# EAGLE schematic Goldfish BigBoard 2- revisions after produced board (EAGLE 6.5.0)
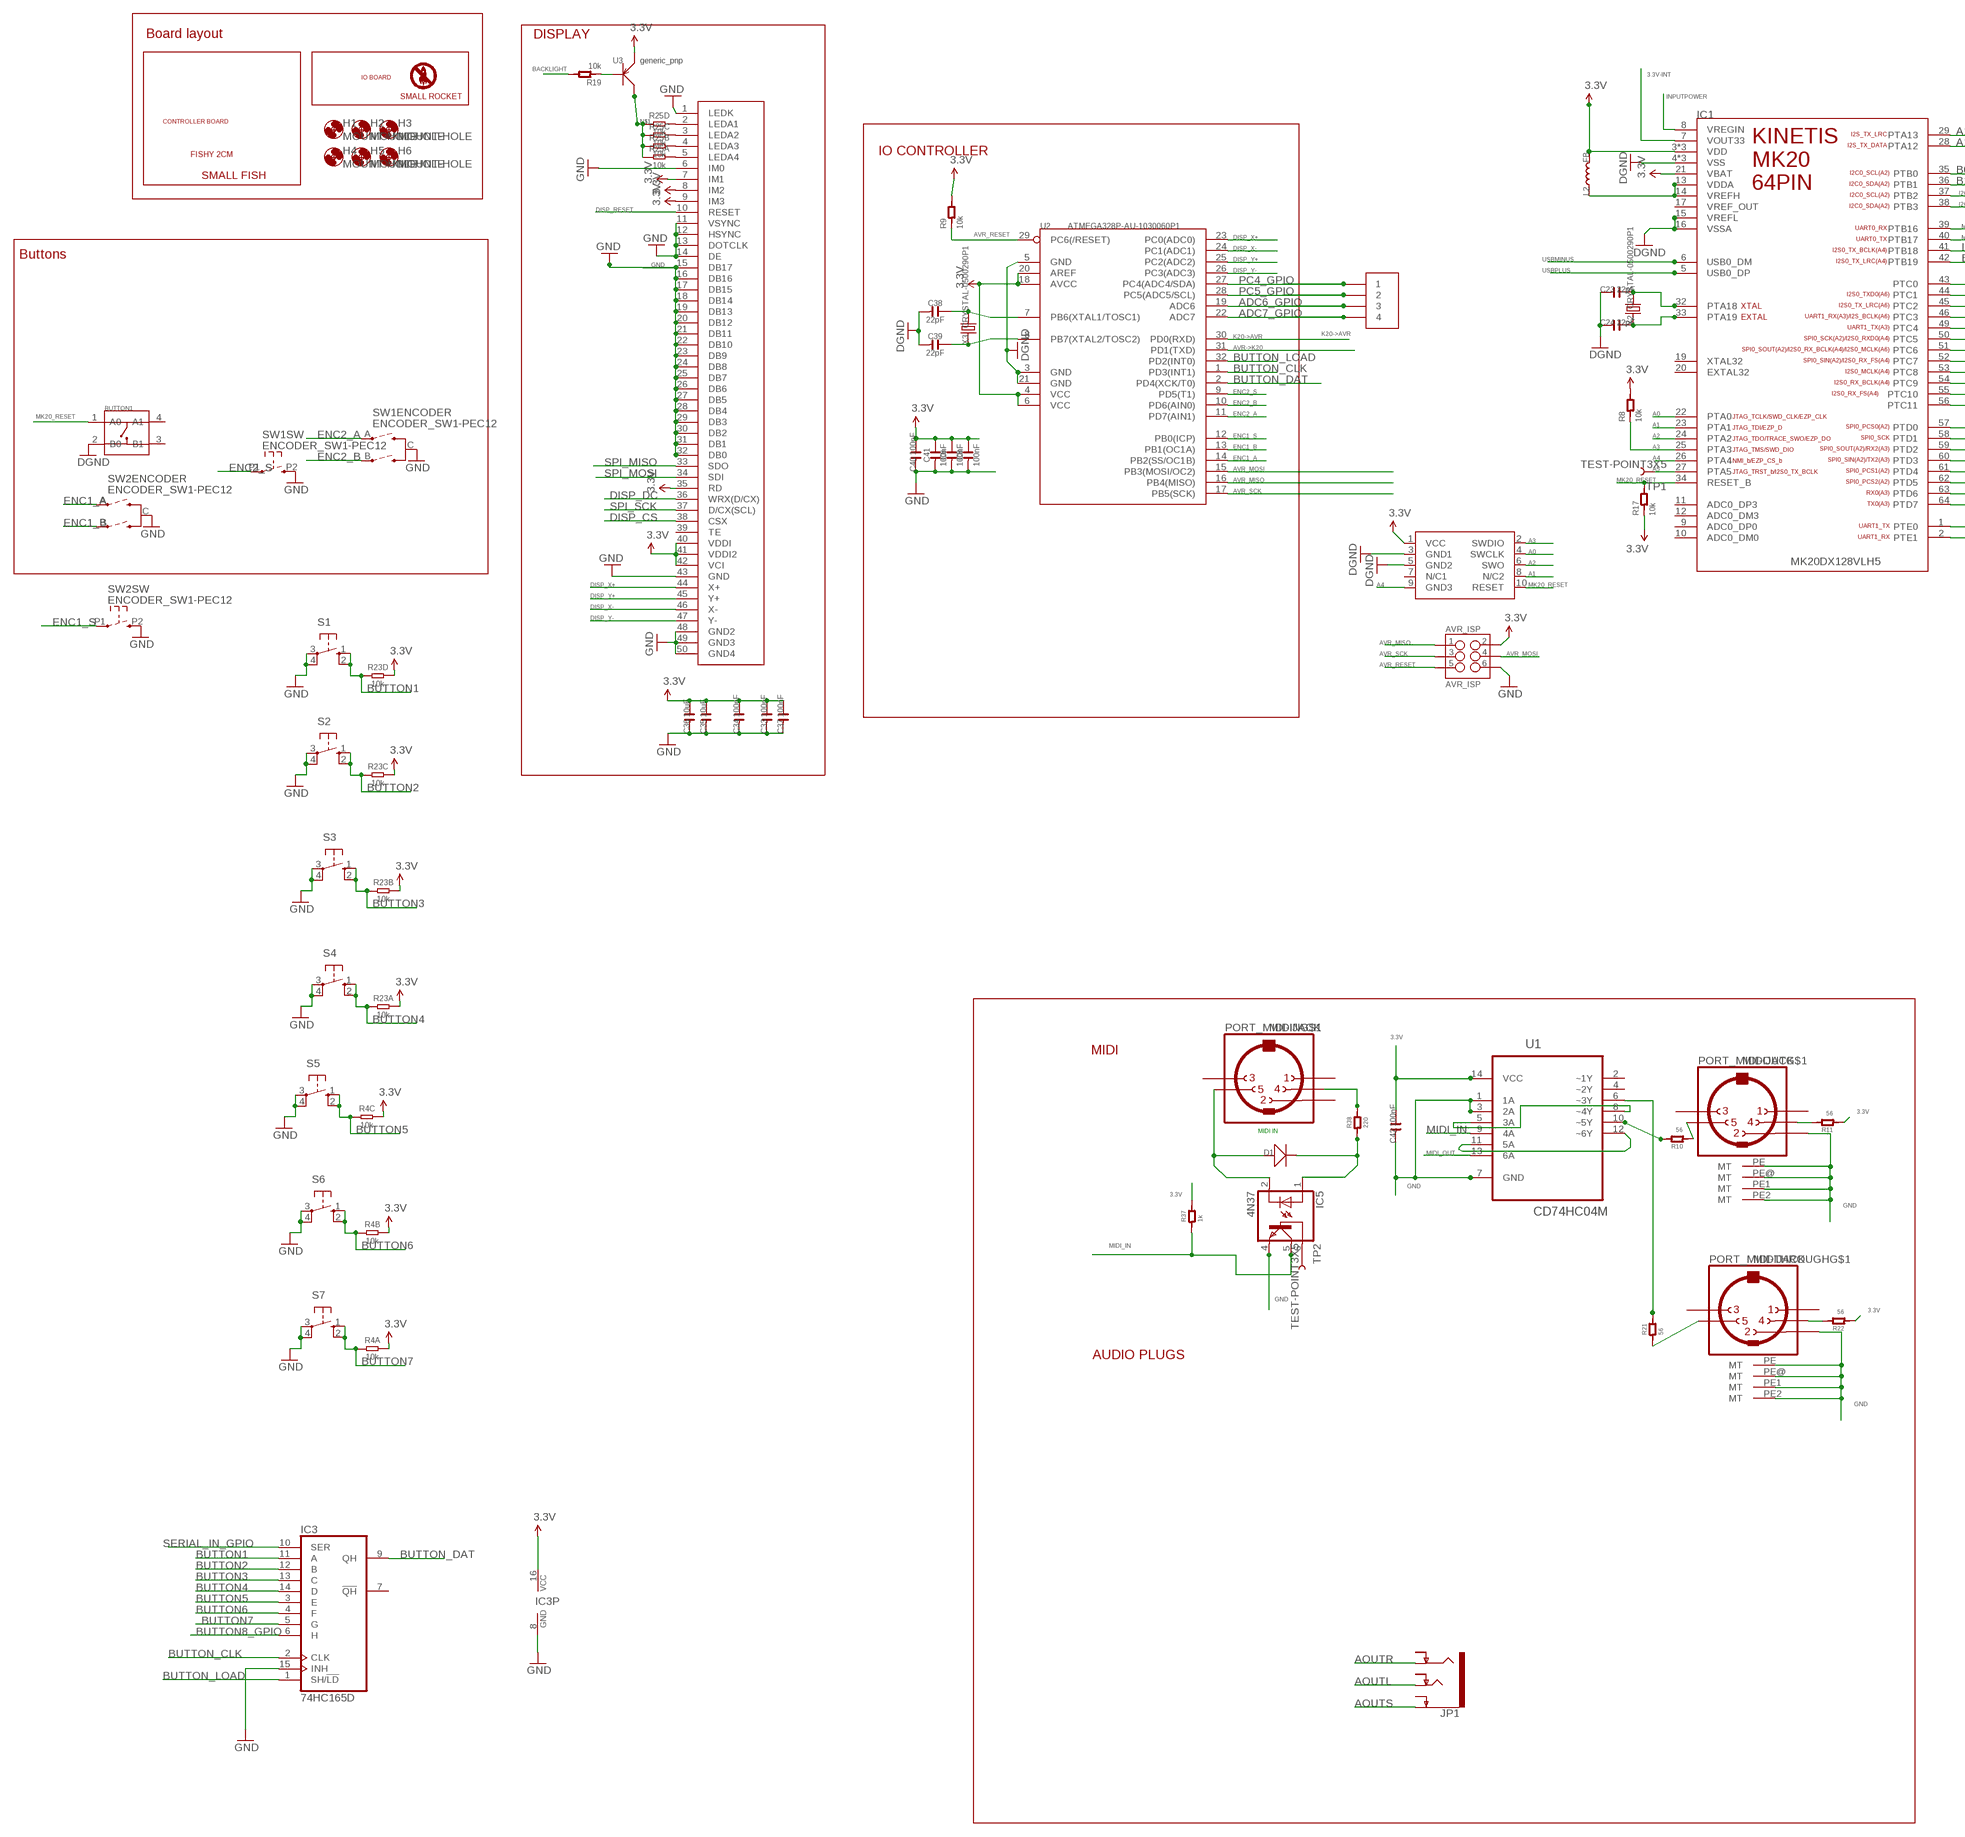
[diagram p0: schematic, sheet 1, part 1 of 3]
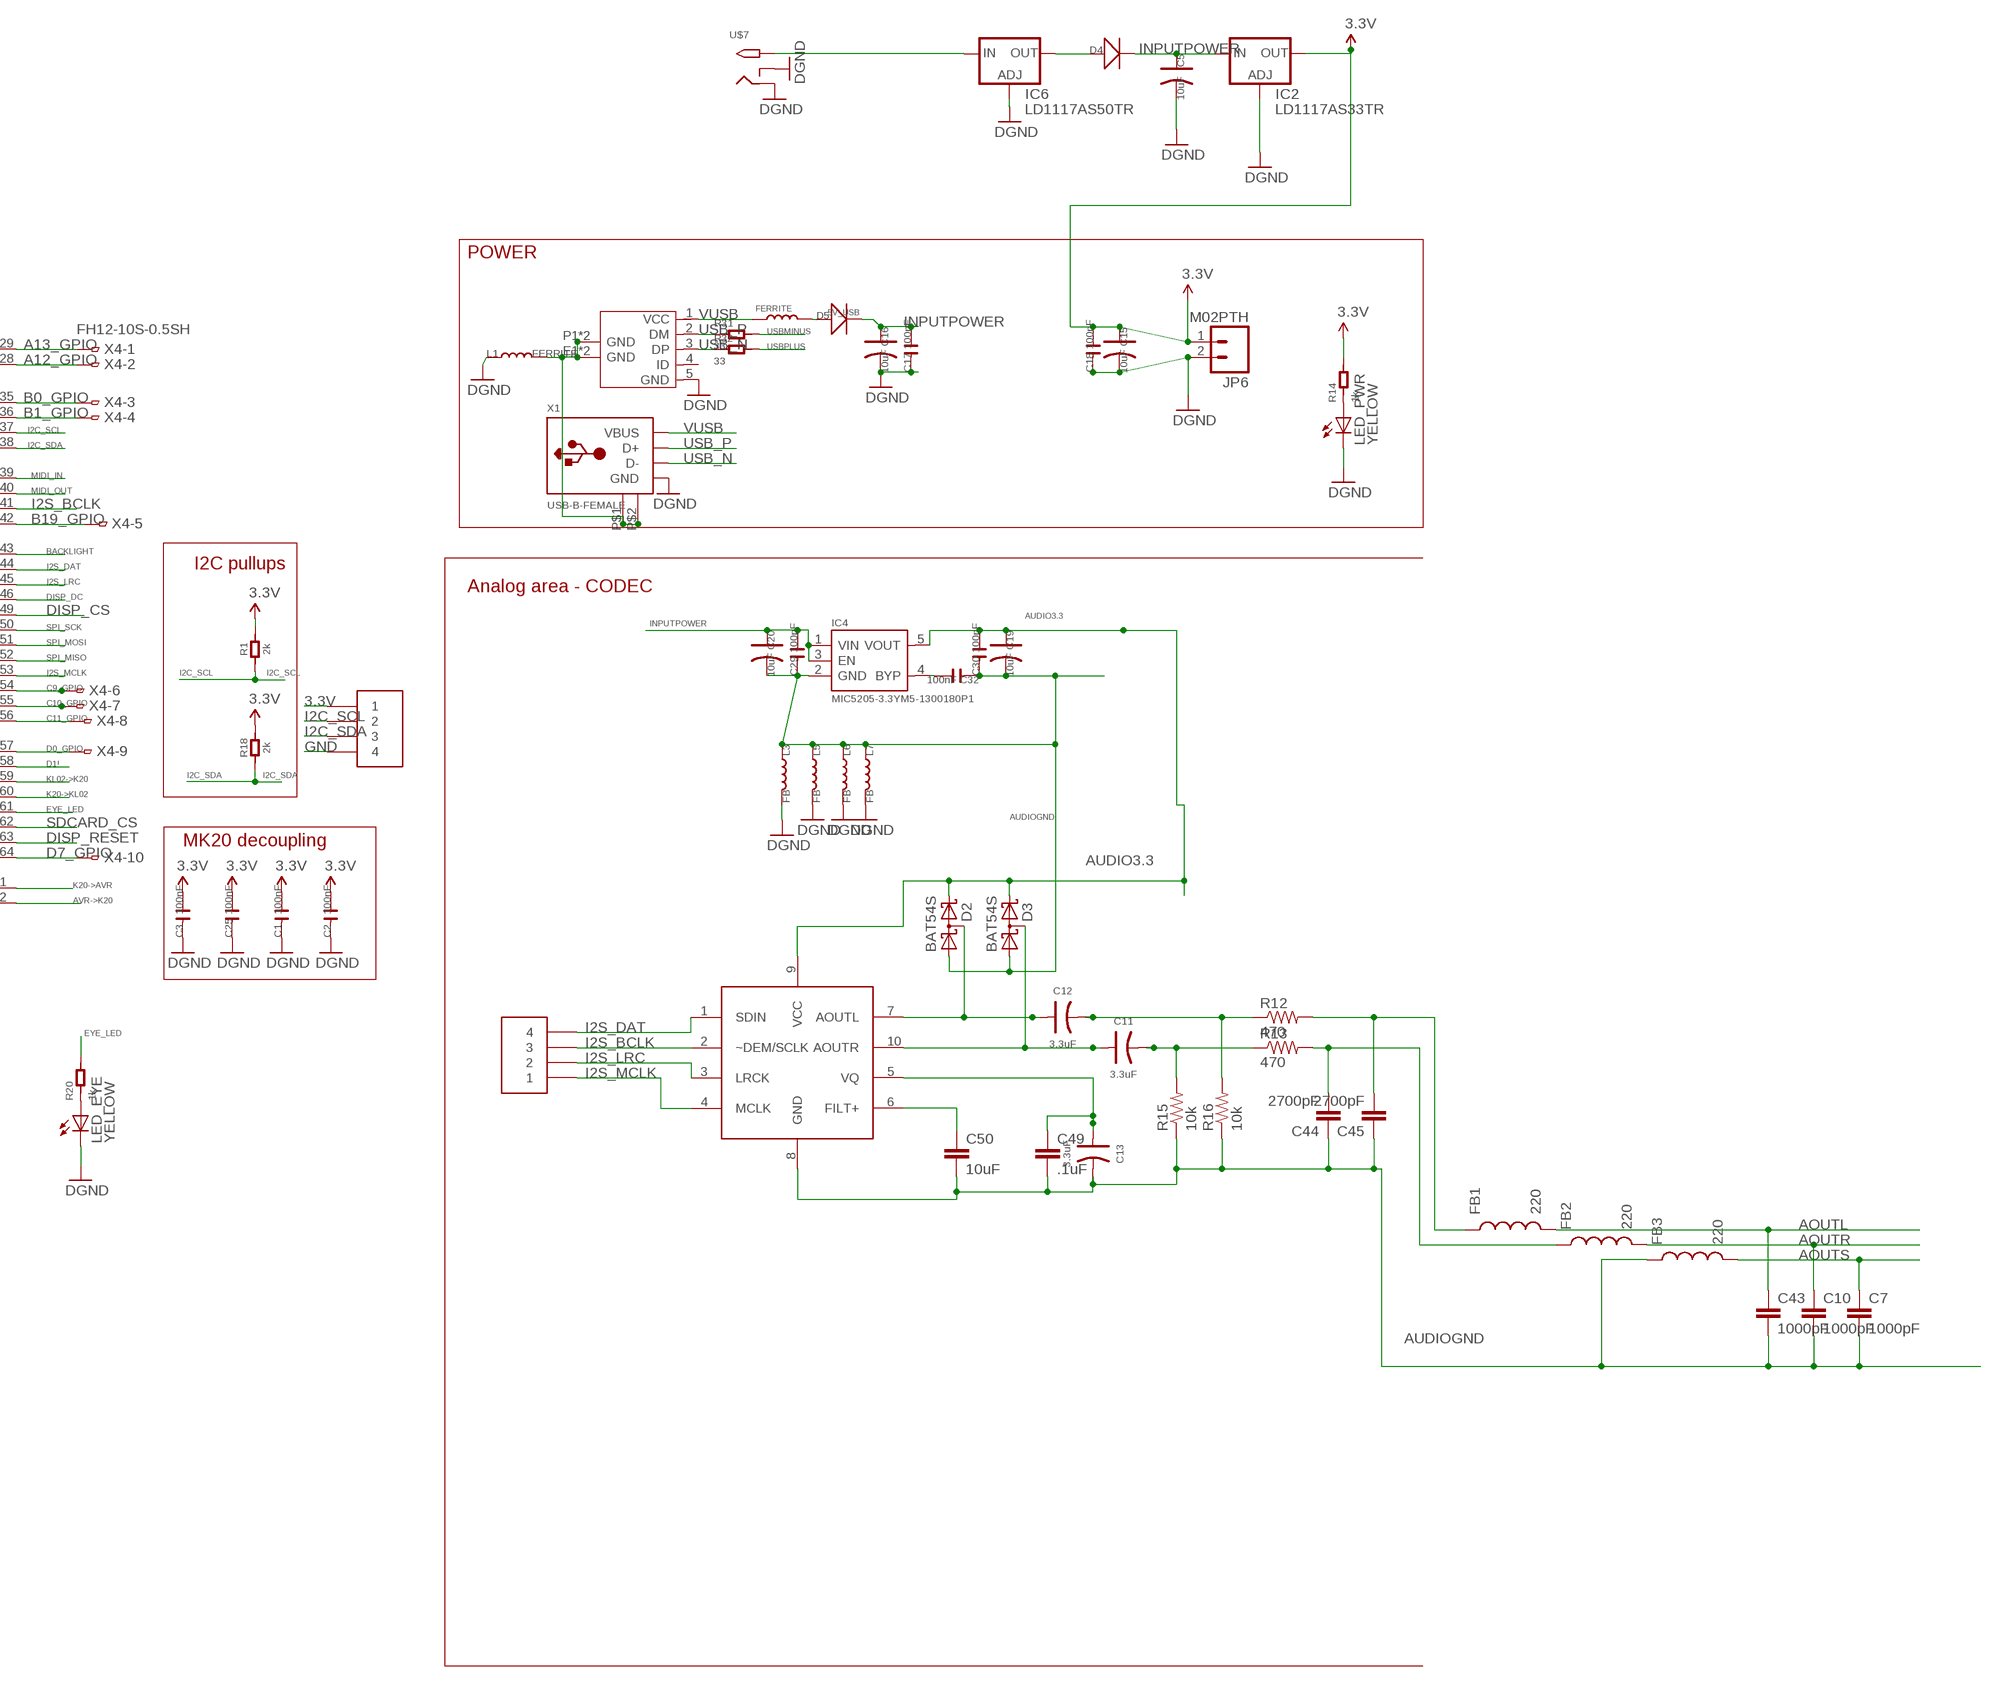
[diagram p1: schematic, sheet 1, part 2 of 3]
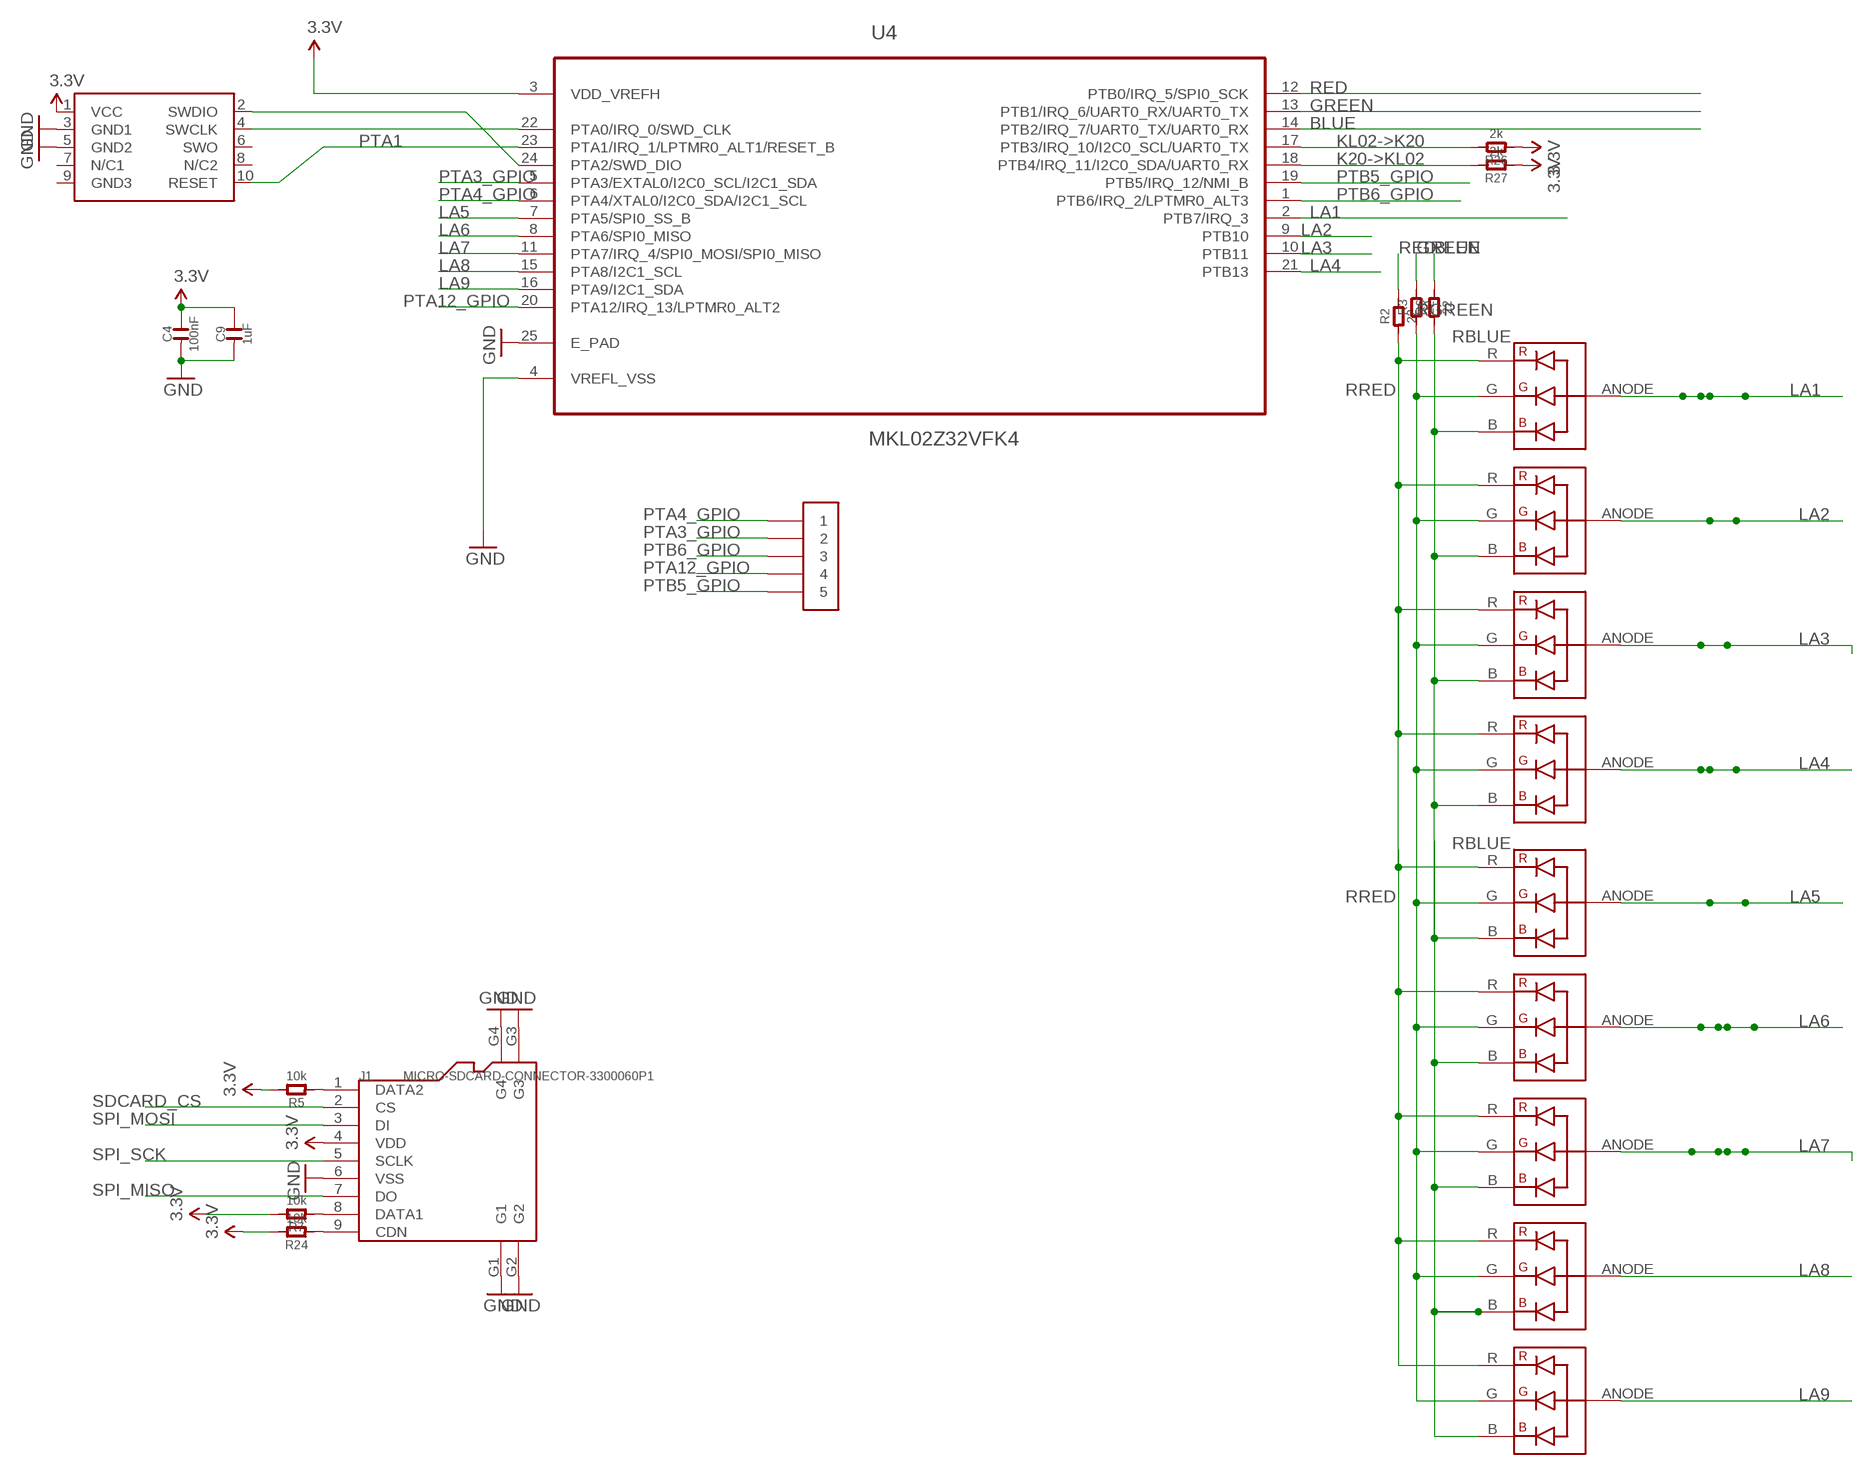
[diagram p2: schematic, sheet 1, part 3 of 3]

## Parts
AVR_ISP  AVR_ISP  M03X2SMT  [2X3_SMT_POSTS]
BUTTON1  BUTTON-4P-3100010P1  [4P-SMD-6.0X6.0X5.0H]
C1  100nF  C-0603  [C0603]
C2  100nF  C-0603  [C0603]
C3  100nF  C-0603  [C0603]
C4  100nF  C-0603  [C0603]
C5  10uF  C-POLAR-A  [AVX-A]
C6  100nF  C-0603  [C0603]
C7  1000pF  CAP0402-CAP  [0402-CAP]
C8  100nF  C-0603  [C0603]
C9  1uF  C-0603  [C0603]
C10  1000pF  CAP0402-CAP  [0402-CAP]
C11  3.3uF  C-POLAR-A  [AVX-A]
C12  3.3uF  C-POLAR-A  [AVX-A]
C13  3.3uF  C-POLAR-A  [AVX-A]
C15  10uF  C-POLAR-A  [AVX-A]
C16  10uF  C-POLAR-A  [AVX-A]
C17  100nF  C-0603  [C0603]
C18  100nF  C-0603  [C0603]
C19  10uF  C-POLAR-A  [AVX-A]
C20  10uF  C-POLAR-A  [AVX-A]
C23  22pF  C-0603  [C0603]
C24  22pF  C-0603  [C0603]
C25  100nF  C-0603  [C0603]
C29  100nF  C-0603  [C0603]
C30  100nF  C-0603  [C0603]
C32  100nF  C-0603  [C0603]
C33  100nF  C-0603  [C0603]
C34  100nF  C-0603  [C0603]
C35  10uF  C-0603  [C0603]
C36  10uF  C-0805  [C0805]
C37  100nF  C-0805  [C0805]
C38  22pF  C-0603  [C0603]
C39  22pF  C-0603  [C0603]
C40  100nF  C-0603  [C0603]
C41  100nF  C-0603  [C0603]
C42  100nF  C-0603  [C0603]
C43  1000pF  CAP0402-CAP  [0402-CAP]
C44  2700pF  CAP0402-CAP  [0402-CAP]
C45  2700pF  CAP0402-CAP  [0402-CAP]
C49  .1uF  CAP0402-CAP  [0402-CAP]
C50  10uF  CAP0402-CAP  [0402-CAP]
D1  D-D1206  [LL-34]
D2  BAT54S  [SOT23]
D3  BAT54S  [SOT23]
D4  D-D1206  [LL-34]
D5  D-D1206  [LL-34]
FB1  220  INDUCTOR0805  [0805]
FB2  220  INDUCTOR0805  [0805]
FB3  220  INDUCTOR0805  [0805]
H1  MOUNT-HOLE  [3.2-NOMARKINGS-SMALLSAFEZONE]
H2  MOUNT-HOLE  [3.2-NOMARKINGS-SMALLSAFEZONE]
H3  MOUNT-HOLE  [3.2-NOMARKINGS-SMALLSAFEZONE]
H4  MOUNT-HOLE  [3.2-NOMARKINGS-SMALLSAFEZONE]
H5  MOUNT-HOLE  [3.2-NOMARKINGS-SMALLSAFEZONE]
H6  MOUNT-HOLE  [3.2-NOMARKINGS-SMALLSAFEZONE]
IC1  MK20DX128VLH5  [MK20DX128VLH5]
IC2  LD1117AS33TR  [SOT223]
IC3  74HC165D  [SO16]
IC4  MIC5205-3.3YM5-1300180P1  [SOT23-5]
IC5  4N37  [DIL06]
IC6  LD1117AS50TR  [SOT223]
J1  MICRO-SDCARD-CONNECTOR-3300060P1  [9P-SMD-W-RING]
J2  MICRO-USB-5P-340015001  [B-SMD-5P]
JP1  AUDIO-JACK4-.25-HORIZ-TRS  [AUDIO-JACK-.25-INCH-HORIZ-PTH]
JP6  M02PTH  [1X02]
L1  FERRITE  L-0603  [L0603]
L2  FB  L-0603  [L0603]
L3  FB  L-0603  [L0603]
L4  FERRITE  L-0603  [L0603]
L5  FB  L-0603  [L0603]
L6  FB  L-0603  [L0603]
L7  FB  L-0603  [L0603]
LED_EYE  YELLOW  LEDCHIP-LED0603  [CHIP-LED0603]
LED_PWR  YELLOW  LEDCHIP-LED0603  [CHIP-LED0603]
PORT_MIDI-IN  MIDIJACK  [CP-2350]
PORT_MIDI-OUT  MIDIJACK  [CP-2350]
PORT_MIDI-THROUGH  MIDIJACK  [CP-2350]
R1  2k  R-0603  [R0603]
R2  22  R-0603  [R0603]
R3  22  R-0603  [R0603]
R4  10k  R-4R  [R1206-8]
R5  10k  R-0603  [R0603]
R6  22  R-0603  [R0603]
R7  10k  R-0603  [R0603]
R8  10k  R-0603  [R0603]
R9  10k  R-0603  [R0603]
R10  56  R-0603  [R0603]
R11  56  R-0603  [R0603]
R12  470  RESISTOR0603-RES  [0603-RES]
R13  470  RESISTOR0603-RES  [0603-RES]
R14  1k  R-0603  [R0603]
R15  10k  RESISTOR0603-RES  [0603-RES]
R16  10k  RESISTOR0603-RES  [0603-RES]
R17  10k  R-0603  [R0603]
R18  2k  R-0603  [R0603]
R19  10k  R-0603  [R0603]
R20  1k  R-0603  [R0603]
R21  56  R-0603  [R0603]
R22  56  R-0603  [R0603]
R23  10k  R-4R  [R1206-8]
R24  10k  R-0603  [R0603]
R25  10k  R-4R  [R1206-8]
R26  2k  R-0603  [R0603]
R27  2k  R-0603  [R0603]
R31  33  R-0603  [R0603]
R32  33  R-0603  [R0603]
R37  1k  R-0603  [R0603]
R38  220  R-0603  [R0603]
S1  40-XX-ROUND  [B3F-40XX-ROUND]
S2  40-XX-ROUND  [B3F-40XX-ROUND]
S3  40-XX-ROUND  [B3F-40XX-ROUND]
S4  40-XX-ROUND  [B3F-40XX-ROUND]
S5  40-XX-ROUND  [B3F-40XX-ROUND]
S6  40-XX-ROUND  [B3F-40XX-ROUND]
S7  40-XX-ROUND  [B3F-40XX-ROUND]
SW1  ENCODER_SW1-PEC12  [PEC12_INCREMENTAL_ENCODER]
SW2  ENCODER_SW1-PEC12  [PEC12_INCREMENTAL_ENCODER]
SWD1  CORTEX_SWD  [M50-3600542]
SWD2  CORTEX_SWD  [M50-3600542]
TP1  TEST-POINT3X5  [PAD.03X.05]
TP2  TEST-POINT3X5  [PAD.03X.05]
U1  CD74HC04M  [SOIC127P600X175-14N]
U2  ATMEGA328P-AU-1030060P1  [TQFP32]
U3  generic_pnp  TRANSISTOR-PNP-041003001  [SOT23]
U4  MKL02Z32VFK4  [QFN50P400X400X100-25N]
U$1  2.8"TFT2.8"TFT  [2.8"TFT]
U$3  FISH2CM_SILK  [FISH_WITHSILK]
U$4  FISH_SMALL  [FISH_SMALL]
U$6  CS4344-DAC  [TSSOP-10]
U$7  2.1MMJACKTHM  [163-179PH-EX]
U$8  SMALLROCKET  [SMALLROCKET]
U$9  RGBLED_COMMONANODE  [3.5X2.8_RGB_LED]
U$10  RGBLED_COMMONANODE  [3.5X2.8_RGB_LED]
U$11  M05  [M05]
U$12  RGBLED_COMMONANODE  [3.5X2.8_RGB_LED]
U$13  RGBLED_COMMONANODE  [3.5X2.8_RGB_LED]
U$14  RGBLED_COMMONANODE  [3.5X2.8_RGB_LED]
U$15  RGBLED_COMMONANODE  [3.5X2.8_RGB_LED]
U$16  RGBLED_COMMONANODE  [3.5X2.8_RGB_LED]
U$17  RGBLED_COMMONANODE  [3.5X2.8_RGB_LED]
U$18  RGBLED_COMMONANODE  [3.5X2.8_RGB_LED]
U$20  M04  [M04]
U$21  M04  [M04]
U$22  M04  [M04]
X1  USB-B-FEMALE  [FCI61729]
X2  CRYSTAL-0500290P1  [2P-SMD-5.0X3.2]
X3  CRYSTAL-0500290P1  [2P-SMD-5.0X3.2]
X4  FH12-10S-0.5SH  [FH12-10S-0.5SH]

## Nets
3.3V [INPUTPOWER]: AVR_ISP.2 C1.2 C2.2 C3.2 C4.2 C6.2 C8.2 C9.2 C15.+ C18.2 C25.2 C33.2 C34.2 C35.2 C36.2 C37.2 C40.2 C41.2 C42.2 IC1.3(VDD) IC1.21(VBAT) IC1.30(VDD) IC1.48(VDD) IC2.2(OUT) IC2.4(OUT) IC3.16(VCC) J1.4(VDD) JP6.1 L2.2 R1.2 R4.6 R4.7 R4.8 R5.2 R7.2 R8.2 R9.2 R11.1 R14.2 R17.1 R18.2 R22.1 R23.5 R23.6 R23.7 R23.8 R24.2 R26.1 R27.1 R37.2 SWD1.1(VCC) SWD2.1(VCC) U1.14(VCC) U2.4(VCC) U2.6(VCC) U2.18(AVCC) U2.20(AREF) U3.2(E) U4.3(VDD_VREFH) U$1.7(IM1) U$1.8(IM2) U$1.9(IM3) U$1.35(RD) U$1.40(VDDI) U$1.41(VDDI2) U$1.42(VCI) U$22.P$1
3.3V-INT: IC1.7(VOUT33)
5V_DC [MEDIUMAUDIO]: D4.A(+) IC6.2(OUT) IC6.4(OUT)
5V_USB: D5.A(+) L4.2
A0: IC1.22(PTA0) SWD1.4(SWCLK)
A1: IC1.23(PTA1) SWD1.8(N/C2)
A2: IC1.24(PTA2) SWD1.6(SWO)
A3: IC1.25(PTA3) R8.1 SWD1.2(SWDIO)
A4: IC1.26(PTA4) SWD1.9(GND3)
A5: IC1.27(PTA5) TP1.P$1
A12_GPIO: IC1.28(PTA12) X4.2
A13_GPIO: IC1.29(PTA13) X4.1
ADC6_GPIO: U2.19(ADC6) U$20.P$3
ADC7_GPIO: U2.22(ADC7) U$20.P$4
AOUTL [MEDIUMAUDIO]: C43.1 FB1.2 JP1.P$6(TIP)
AOUTL_C: C12.+ D2.3(C1A2) U$6.7(AOUTL)
AOUTL_FB [MEDIUMAUDIO]: C45.2 FB1.1 R12.2
AOUTL_R: C12.- R12.1 R16.2
AOUTR [MEDIUMAUDIO]: C10.1 FB2.2 JP1.P$4(RING)
AOUTR_C: C11.+ D3.3(C1A2) U$6.10(AOUTR)
AOUTR_FB [MEDIUMAUDIO]: C44.2 FB2.1 R13.2
AOUTR_R: C11.- R13.1 R15.2
AOUTS [MEDIUMAUDIO]: C7.1 FB3.2 JP1.P$2(EARTH)
AUDIO3.3 [GND]: C19.+ C30.2 D2.2(C2) D3.2(C2) IC4.5(VOUT) U$6.9(VCC)
AUDIOGND: C7.2 C10.2 C13.- C19.- C20.- C29.1 C30.1 C32.1 C43.2 C44.1 C45.1 C49.2 C50.2 D2.1(A1) D3.1(A1) FB3.1 IC4.2(GND) L3.1 L5.1 L6.1 L7.1 R15.1 R16.1 U$6.8(GND)
AVR->K20: IC1.2(PTE1) U2.31(PD1(TXD))
AVR_MISO: AVR_ISP.1 U2.16(PB4(MISO))
AVR_MOSI: AVR_ISP.4 U2.15(PB3(MOSI/OC2))
AVR_RESET: AVR_ISP.5 R9.1 U2.29(PC6(/RESET))
AVR_SCK: AVR_ISP.3 U2.17(PB5(SCK))
B0_GPIO: IC1.35(PTB0) X4.3
B1_GPIO: IC1.36(PTB1) X4.4
B19_GPIO: IC1.42(PTB19) X4.5
BACKLIGHT: IC1.43(PTC0) R19.2
BLUE: R6.2 U4.14(PTB2/IRQ_7/UART0_TX/UART0_RX)
BUTTON1: IC3.11(A) R23.4 S1.1(S) S1.2(S1)
BUTTON2: IC3.12(B) R23.3 S2.1(S) S2.2(S1)
BUTTON3: IC3.13(C) R23.2 S3.1(S) S3.2(S1)
BUTTON4: IC3.14(D) R23.1 S4.1(S) S4.2(S1)
BUTTON5: IC3.3(E) R4.3 S5.1(S) S5.2(S1)
BUTTON6: IC3.4(F) R4.2 S6.1(S) S6.2(S1)
BUTTON7: IC3.5(G) R4.1 S7.1(S) S7.2(S1)
BUTTON8_GPIO: IC3.6(H)
BUTTON_CLK: IC3.2(CLK) U2.1(PD3(INT1))
BUTTON_DAT: IC3.9(QH) U2.2(PD4(XCK/T0))
BUTTON_LOAD: IC3.1(SH/!LD) U2.32(PD2(INT0))
C9_GPIO: IC1.54(PTC9) X4.6
C10_GPIO: IC1.55(PTC10) X4.7
C11_GPIO: IC1.56(PTC11) X4.8
D0_GPIO: IC1.57(PTD0) X4.9
D1!: IC1.58(PTD1)
D7_GPIO: IC1.64(PTD7) X4.10
DISP_CS: IC1.49(PTC4) U$1.38(CSX)
DISP_DC: IC1.46(PTC3) U$1.36(WRX(D/CX))
DISP_RESET: IC1.63(PTD6) U$1.10(RESET)
DISP_X+: U2.23(PC0(ADC0)) U$1.44(X+)
DISP_X-: U2.24(PC1(ADC1)) U$1.46(X-)
DISP_Y+: U2.25(PC2(ADC2)) U$1.45(Y+)
DISP_Y-: U2.26(PC3(ADC3)) U$1.47(Y-)
ENC1_A: SW2.A(ENCODER:A) U2.14(PB2(SS/OC1B))
ENC1_B: SW2.B(ENCODER:B) U2.13(PB1(OC1A))
ENC1_S: SW2.P1 U2.12(PB0(ICP))
ENC2_A: SW1.A(ENCODER:A) U2.11(PD7(AIN1))
ENC2_B: SW1.B(ENCODER:B) U2.10(PD6(AIN0))
ENC2_S: SW1.P1 U2.9(PD5(T1))
EYE_LED: IC1.61(PTD4) R20.2
FILT+: C50.1 U$6.6(FILT+)
GND: AVR_ISP.6 BUTTON1.2(B0) C1.1 C2.1 C3.1 C4.1 C5.- C6.1 C8.1 C9.1 C15.- C16.- C17.1 C18.1 C23.1 C24.1 C25.1 C33.1 C34.1 C35.1 C36.1 C37.1 C38.1 C39.1 C40.1 C41.1 C42.1 IC1.4(VSS) IC1.15(VREFL) IC1.16(VSSA) IC1.31(VSS) IC1.47(VSS) IC2.1(ADJ) IC3.8(GND) IC3.15(INH) IC5.4(EMI) IC6.1(ADJ) J1.6(VSS) J1.G1 J1.G2 J1.G3 J1.G4 J2.5(GND) JP6.2 L1.1 L3.2 L5.2 L6.2 L7.2 LED_EYE.C LED_PWR.C PORT_MIDI-OUT.2 PORT_MIDI-OUT.PE1(MT) PORT_MIDI-OUT.PE2(MT) PORT_MIDI-OUT.PE(MT) PORT_MIDI-OUT.PE@(MT) PORT_MIDI-THROUGH.2 PORT_MIDI-THROUGH.PE1(MT) PORT_MIDI-THROUGH.PE2(MT) PORT_MIDI-THROUGH.PE(MT) PORT_MIDI-THROUGH.PE@(MT) S1.3(P) S1.4(P1) S2.3(P) S2.4(P1) S3.3(P) S3.4(P1) S4.3(P) S4.4(P1) S5.3(P) S5.4(P1) S6.3(P) S6.4(P1) S7.3(P) S7.4(P1) SW1.C(ENCODER:C) SW1.P2 SW2.C(ENCODER:C) SW2.P2 SWD1.3(GND1) SWD1.5(GND2) SWD2.3(GND1) SWD2.5(GND2) U1.1(1A) U1.3(2A) U1.7(GND) U2.3(GND) U2.5(GND) U2.21(GND) U4.4(VREFL_VSS) U4.25(E_PAD) U$1.1(LEDK) U$1.6(IM0) U$1.11(VSYNC) U$1.12(HSYNC) U$1.13(DOTCLK) U$1.14(DE) U$1.15(DB17) U$1.16(DB16) U$1.17(DB15) U$1.18(DB14) U$1.19(DB13) U$1.20(DB12) U$1.21(DB11) U$1.22(DB10) U$1.23(DB9) U$1.24(DB8) U$1.25(DB7) U$1.26(DB6) U$1.27(DB5) U$1.28(DB4) U$1.29(DB3) U$1.30(DB2) U$1.31(DB1) U$1.32(DB0) U$1.43(GND) U$1.48(GND2) U$1.49(GND3) U$1.50(GND4) U$7.RING U$7.RING_SW U$22.P$4 X1.4(GND) ; supply symbol labelled DGND
GREEN: R3.2 U4.13(PTB1/IRQ_6/UART0_RX/UART0_TX)
I2C_SCL: IC1.37(PTB2) R1.1 U$22.P$2
I2C_SDA: IC1.38(PTB3) R18.1 U$22.P$3
I2S_BCLK: IC1.41(PTB18) U$6.2(~DEM/SCLK) U$21.P$3
I2S_DAT: IC1.44(PTC1) U$6.1(SDIN) U$21.P$4
I2S_LRC: IC1.45(PTC2) U$6.3(LRCK) U$21.P$2
I2S_MCLK: IC1.53(PTC8) U$6.4(MCLK) U$21.P$1
IC1 [MEDIUMAUDIO]: U1.11(5A) U1.12(~6Y)
INPUTPOWER [INPUTPOWER]: C5.+ C16.+ C17.2 C20.+ C29.2 D4.C(-) D5.C(-) IC1.8(VREGIN) IC2.3(IN) IC4.1(VIN) IC4.3(EN)
K20->AVR: IC1.1(PTE0) U2.30(PD0(RXD))
K20->KL02: IC1.60(PTD3) R27.2 U4.18(PTB4/IRQ_11/I2C0_SDA/UART0_RX)
KL02->K20: IC1.59(PTD2) R26.2 U4.17(PTB3/IRQ_10/I2C0_SCL/UART0_TX)
LA1: U4.2(PTB7/IRQ_3) U$9.ANODE
LA2: U4.9(PTB10) U$10.ANODE
LA3: U4.10(PTB11) U$12.ANODE
LA4: U4.21(PTB13) U$13.ANODE
LA5: U4.7(PTA5/SPI0_SS_B) U$14.ANODE
LA6: U4.8(PTA6/SPI0_MISO) U$15.ANODE
LA7: U4.11(PTA7/IRQ_4/SPI0_MOSI/SPI0_MISO) U$16.ANODE
LA8: U4.15(PTA8/I2C1_SCL) U$17.ANODE
LA9: U4.16(PTA9/I2C1_SDA) U$18.ANODE
MIDI_IN: IC1.39(PTB16) IC5.5(COL) R37.1 U1.9(4A)
MIDI_OUT: IC1.40(PTB17) U1.13(6A)
MK20_RESET: BUTTON1.1(A0) IC1.34(RESET_B) R17.2 SWD1.10(RESET)
N$1: R25.1 R25.2 R25.3 R25.4 U3.3(C)
N$2: LED_PWR.A R14.1
N$3: J2.E1(GND) J2.E2(GND) J2.P1(GND) J2.P2(GND) L1.2 X1.P$1(GND1) X1.P$2(GND2)
N$4 [MEDIUMAUDIO]: R10.2 U1.10(~5Y)
N$5: R25.5 U$1.2(LEDA1)
N$6 [MEDIUMAUDIO]: PORT_MIDI-THROUGH.5 R21.1
N$7 [BIGAUDIO]: IC6.3(IN) U$7.TIP
N$8: SWD2.4(SWCLK) U4.22(PTA0/IRQ_0/SWD_CLK)
N$9: C23.2 IC1.32(PTA18) X2.2
N$10: C24.2 IC1.33(PTA19) X2.1
N$11: R19.1 U3.1(B)
N$12: SWD2.2(SWDIO) U4.24(PTA2/SWD_DIO)
N$13: C32.2 IC4.4(BYP)
N$14: J1.1(DATA2) R5.1
N$15: IC5.6(BAS) TP2.P$1
N$16: R25.6 U$1.3(LEDA2)
N$17: LED_EYE.A R20.1
N$18: J1.8(DATA1) R7.1
N$19: J1.9(CDN) R24.1
N$20 [MEDIUMAUDIO]: PORT_MIDI-THROUGH.4 R22.2
N$21: R25.7 U$1.4(LEDA3)
N$22: R25.8 U$1.5(LEDA4)
N$29 [MEDIUMAUDIO]: PORT_MIDI-OUT.5 R10.1
N$30 [MEDIUMAUDIO]: PORT_MIDI-OUT.4 R11.2
N$33: IC1.13(VDDA) IC1.14(VREFH) L2.1
N$35: C38.2 U2.7(PB6(XTAL1/TOSC1)) X3.2
N$36: C39.2 U2.8(PB7(XTAL2/TOSC2)) X3.1
N$64 [MEDIUMAUDIO]: R21.2 U1.6(~3Y)
N$66: U1.5(3A) U1.8(~4Y)
N$87 [MEDIUMAUDIO]: D1.A(+) IC5.2(C) PORT_MIDI-IN.5
N$90 [MEDIUMAUDIO]: D1.C(-) IC5.1(A) R38.1
N$234 [MEDIUMAUDIO]: PORT_MIDI-IN.4 R38.2
PC4_GPIO: U2.27(PC4(ADC4/SDA)) U$20.P$1
PC5_GPIO: U2.28(PC5(ADC5/SCL)) U$20.P$2
PTA1: SWD2.10(RESET) U4.23(PTA1/IRQ_1/LPTMR0_ALT1/RESET_B)
PTA3_GPIO: U4.5(PTA3/EXTAL0/I2C0_SCL/I2C1_SDA) U$11.P$2
PTA4_GPIO: U4.6(PTA4/XTAL0/I2C0_SDA/I2C1_SCL) U$11.P$1
PTA12_GPIO: U4.20(PTA12/IRQ_13/LPTMR0_ALT2) U$11.P$4
PTB5_GPIO: U4.19(PTB5/IRQ_12/NMI_B) U$11.P$5
PTB6_GPIO: U4.1(PTB6/IRQ_2/LPTMR0_ALT3) U$11.P$3
RBLUE: R6.1 U$9.B U$10.B U$12.B U$13.B U$14.B U$15.B U$16.B U$17.B U$18.B
RED: R2.2 U4.12(PTB0/IRQ_5/SPI0_SCK)
RGREEN: R3.1 U$9.G U$10.G U$12.G U$13.G U$14.G U$15.G U$16.G U$17.G U$18.G
RRED: R2.1 U$9.R U$10.R U$12.R U$13.R U$14.R U$15.R U$16.R U$17.R U$18.R
SDCARD_CS: IC1.62(PTD5) J1.2(CS)
SERIAL_IN_GPIO: IC3.10(SER)
SPI_MISO: IC1.52(PTC7) J1.7(DO) U$1.33(SDO)
SPI_MOSI: IC1.51(PTC6) J1.3(DI) U$1.34(SDI)
SPI_SCK: IC1.50(PTC5) J1.5(SCLK) U$1.37(D/CX(SCL))
USB_N: J2.3(DP) R32.1 X1.2(D-)
USB_P: J2.2(DM) R31.1 X1.3(D+)
USBMINUS: IC1.6(USB0_DM) R31.2
USBPLUS: IC1.5(USB0_DP) R32.2
VQ: C13.+ C49.1 U$6.5(VQ)
VUSB: J2.1(VCC) L4.1 X1.1(VBUS)
Unconnected: BUTTON1.3(B1) BUTTON1.4(A1) IC1.9(ADC0_DP0) IC1.10(ADC0_DM0) IC1.11(ADC0_DP3) IC1.12(ADC0_DM3) IC1.17(VREF_OUT) IC1.19(XTAL32) IC1.20(EXTAL32) IC3.7(!QH) J2.4(ID) JP1.P$3(EARTH-NORM) JP1.P$5(RING-NORM) JP1.P$7(TIP-NORM) PORT_MIDI-IN.1 PORT_MIDI-IN.2 PORT_MIDI-IN.3 PORT_MIDI-IN.PE1(MT) PORT_MIDI-IN.PE2(MT) PORT_MIDI-IN.PE(MT) PORT_MIDI-IN.PE@(MT) PORT_MIDI-OUT.1 PORT_MIDI-OUT.3 PORT_MIDI-THROUGH.1 PORT_MIDI-THROUGH.3 R4.4 R4.5 SWD1.7(N/C1) SWD2.6(SWO) SWD2.7(N/C1) SWD2.8(N/C2) SWD2.9(GND3) U1.2(~1Y) U1.4(~2Y) U$1.39(TE)

## Notes on the sheet
- Board layout | DISPLAY
- POWER
- IO BOARD
- CONTROLLER BOARD
- IO CONTROLLER
- Buttons
- I2C pullups
- Analog area - CODEC
- MK20 decoupling
- MIDI
- MIDI IN
- AUDIO PLUGS

## Library data of the parts
AVR_ISP = zephod-components:M03X2: 2x3 .1" header. Shrouded, with keying- CONN-10681 SMT- CONN-11415 Pogo pins- HW-11044; PROD_ID: CONN-11415
BUTTON1 = zephod-components:BUTTON-4P
C1-C3 C17 C18 C23-C25 C29 C30 C32-C37 C40 C42 = OPL Eagle Library:C*
C4 C6 C8 C9 C38 C39 C41 = OPL:C*
C5 C15 C16 C19 C20 = OPL Eagle Library:C-POLAR*
C7 C10 C43-C45 C49 C50 = 1x05smd:CAP: Capacitor Standard 0603 ceramic capacitor, and 0.1" leaded capacitor.
C11-C13 = OPL:C-POLAR*
D1 D4 D5 = OPL:D*: DIODE
D2 D3 = diode:BAT54S: Schottky Diodes Pin connection corrected 2011-05-04 Source: Fairchild .. BAT54.pdf
FB1-FB3 = SparkFun-Passives:INDUCTOR: Inductors Basic Inductor/Choke - 0603 and 1206. Footprints are not proven and vary greatly between part numbers. SRN6045- 33uH, 20% 1.4A SDR0403-560KL - 56uH, 10%, 500mA RMS/740mA peak
H1-H6 = zephod-components:MOUNT-HOLE: MOUNTING HOLE with drill center marker
IC1 = zephod-components:MK20DX128VLH5: Teensy 3.0 Processing Unit - MK20DX128VLH5 ARM Cortex M0 Datasheet: http://cache.freescale.com/files/32bit/doc/data_sheet/K20P64M50SF0.pdf
IC2 IC6 = ld-components:LD1117A?*: Low drop fixed and adjustable positive voltage regulators 1 A Source: http://www.st.com/stonline/products/literature/ds/7194/ld1117axx.pdf
IC3 = 74xx-eu:74*165: 8-bit parallel load SHIFT REGISTER
IC4 = OPL Eagle Library:MIC5205-3.3YM5: The MIC5205 is an efficient linear voltage regulator with ultra-low-noise output, very low dropout voltage (typically 17mV at light loads and 165mV at 150mA), and very low ground current (600µA at 100mA output). The MIC5205 offers better than 1% initial accuracy. datasheet here: http://www.micrel.com/product-info/prod/5205.shtml
IC5 = optocoupler:4N37: OPTO COUPLER Source: http://www.fairchildsemi.com/pf/4N/4N35-M.html; MF: FAIRCHILD SEMICONDUCTOR; MPN: 4N37; OC_FARNELL: 1612456; OC_NEWARK: 72K9948
J1 = OPL:MICRO-SDCARD-CONNECTOR: Micro SD Card
J2 = OPL Eagle Library:MICRO-USB-5P: ST-USB-001E：MICRO USB B SMD R/A
JP1 = SparkFun-Connectors:AUDIO-JACK4-.25-HORIZ-TRS: 1/4" TRS jack, horizontal Production SKU: COM-11144 Footprint unproven - datasheet and part seem to be slightly different; PROD_ID: COM-11144
JP6 = SparkFun-Connectors:M02: Standard 2-pin 0.1" header. Use with - straight break away headers ( PRT-00116) - right angle break away headers (PRT-00553) - swiss pins (PRT-00743) - machine pins (PRT-00117) - female headers (PRT-00115) Molex polarized connector foot print use with: PRT-08233 with associated crimp pins and housings. 2.54_SCREWTERM for use with PRT-10571. 3.5mm Screw Terminal footprints for PRT-08084 5mm Screw Terminal footprints for use with PRT-08433
L1-L7 = OPL Eagle Library:L*
LED_EYE LED_PWR = adafruit:LED: LED OSRAM: - CHIPLED LG R971, LG N971, LY N971, LG Q971, LY Q971, LO R971, LY R971 LH N974, LH R974 LS Q976, LO Q976, LY Q976 LO Q996 - Hyper CHIPLED LW Q18S LB Q993, LB Q99A, LB R99A - SideLED LS A670, LO A670, LY A670, LG A670, LP A670 LB A673, LV A673, LT A673, LW A673 LH A674 LY A675 LS A676, LA A676, LO A676, LY A676, LW A676 LS A679, LY A679, LG A679 - Hyper Micro SIDELED® LS Y876, LA Y876, LO Y876, LY Y876 LT Y87S - SmartLED LW L88C, LW L88S LB L89C, LB L89S, LG L890 LS L89K, LO L89K, LY L89K LS L896, LA L896, LO L896, LY L896 - TOPLED LS T670, LO T670, LY T670, LG T670, LP T670 LSG T670, LSP T670, LSY T670, LOP T670, LYG T670 LG T671, LOG T671, LSG T671 LB T673, LV T673, LT T673, LW T673 LH T674 LS T676, LA T676, LO T676, LY T676, LB T676, LH T676, LSB T676, LW T676 LB T67C, LV T67C, LT T67C, LS T67K, LO T67K, LY T67K, LW E67C LS E67B, LA E67B, LO E67B, LY E67B, LB E67C, LV E67C, LT E67C LW T67C LS T679, LY T679, LG T679 LS T770, LO T770, LY T770, LG T770, LP T770 LB T773, LV T773, LT T773, LW T773 LH T774 LS E675, LA E675, LY E675, LS T675 LS T776, LA T776, LO T776, LY T776, LB T776 LHGB T686 LT T68C, LB T68C - Hyper Mini TOPLED® LB M676 - Mini TOPLED Santana® LG M470 LS M47K, LO M47K, LY M47K Source: http://www.osram.convergy.de/
PORT_MIDI-IN PORT_MIDI-OUT PORT_MIDI-THROUGH = adafruit:MIDIJACK: DIN 5 jack also known as MIDI jack A modification of conn-hirshman:MAB5SH with two options for the grounding 'teeth'
R1-R3 R5-R7 R18 R24 R26 R27 = OPL:R*
R4 R23 R25 = OPL:R-4R*: Resistor Array
R8-R11 R14 R17 R19-R22 R31 R32 R37 R38 = OPL Eagle Library:R*
R12 R13 R15 R16 = 1x05smd:RESISTOR: Resistor Basic schematic elements and footprints for 0603, 1206, and PTH 1/10th watt (small) resistors.
S1-S7 = adafruit:40-XX: OMRON SWITCH
SW1 SW2 = dp_devices:ENCODER_SW1: Incremental Encoder with push switch
SWD1 SWD2 = carrilib with jtags:CORTEX_SWD: .05" Cortex M Connector in SWD mode Manufacturer: Generic Part Number: Cortex M SWD Notes: I use Harwin M50-3600542 connectors
TP1 TP2 = SparkFun-Passives:TEST-POINT: Bare copper test points for troubleshooting or ICT
U1 = FarnellThings:CD74HC04M: High-Speed CMOS Logic Hex Inverter; MPN: CD74HC04M; OC_FARNELL: 1103154; OC_NEWARK: 06F3024; PACKAGE: SOIC-14; SUPPLIER: Texas Instruments
U2 = OPL:ATMEGA328P-AU: 8-bit AVR Microcontroller with 32K Bytes In-System Programmable Flash
U3 = OPL:TRANSISTOR-PNP*: S8550：PNP Transistor
U4 = FarnellThings:MKL02Z32VFK4: IC, MCU, 32BIT, CORTEX M0+, 48MHZ, QFN-24; MPN: MKL02Z32VFK4; OC_FARNELL: 2321481; OC_NEWARK: 61W9887; PACKAGE: QFN-24; SUPPLIER: FREESCALE SEMICONDUCTOR
U$1 = zephod-tft:2.8"TFT: EastRising 2.8" SPI TFT Order #: ER-TFT028-4
U$3 = zephod-components:FISH2CM
U$4 = zephod-components:FISH_SMALL
U$6 = Strutz Electronic Industries:CS4344-DAC
U$7 = ld-components:2.1MMJACK: DC Power Connectors PCB 2.1MM. Mouser part #163-179PH-EX 2.1mm x 5.5mm SMT DC jack with internal switch. Digikey part #PJ-002A-SMT, 4UCON part #03267 By microbuilder.eu & adafruit.com & ld
U$8 = zephod-components:SMALLROCKET
U$9 U$10 U$12-U$18 = zephod-components:RGBLED_COMMONANODE
U$11 = zephod-components:M05
U$20-U$22 = zephod-components:M04
X1 = ld-components:USB-B-FEMALE: USB type B receptacle FCI 61729-59796
X2 = OPL Eagle Library:CRYSTAL*
X3 = OPL:CRYSTAL*
X4 = con-hirose:FH12-10S-0.5S: 0.5mm Pitch Connectors For FPC/FFC Source: Data sheet <http://www.hirose.co.jp/cataloge_hp/e58605370.pdf>; MPN: FH12-10S-0.5SH(55); OC_FARNELL: 1324540; OC_NEWARK: 34M6152

## Net classes
1 GND: width 0.254 mm
2 BIGAUDIO: width 1.016 mm
3 MEDIUMAUDIO: width 0.381 mm
4 INPUTPOWER: width 0.254 mm